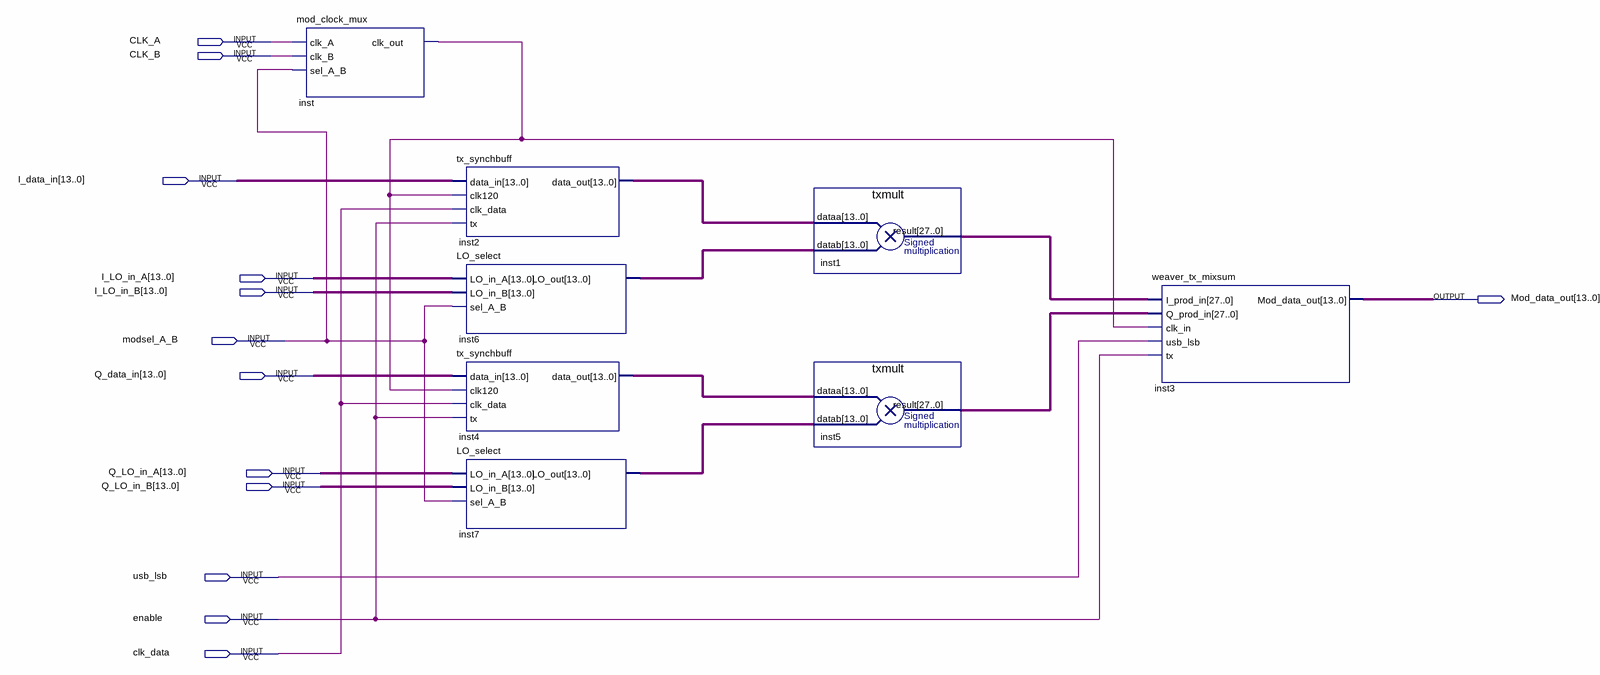
[diagram p0: schematic sheet]
// Quartus schematic weaver_tx_mult.bdf as structural Verilog: 8 symbols, 13 pins
module weaver_tx_mult (
  input  CLK_A,
  input  CLK_B,
  input  [13:0] I_data_in,
  input  [13:0] I_LO_in_A,
  input  [13:0] I_LO_in_B,
  input  modsel_A_B,
  input  [13:0] Q_data_in,
  input  [13:0] Q_LO_in_A,
  input  [13:0] Q_LO_in_B,
  input  usb_lsb,
  input  enable,
  input  clk_data,
  output [13:0] Mod_data_out
);

  wire inst_clk_out;
  wire [13:0] inst2_data_out, inst4_data_out, inst6_lo_out, inst7_lo_out;
  wire [27:0] inst1_result, inst5_result;

  mod_clock_mux inst (.clk_A(CLK_A), .clk_B(CLK_B), .sel_A_B(modsel_A_B), .clk_out(inst_clk_out));
  tx_synchbuff inst2 (
    .data_in(I_data_in), .clk120(inst_clk_out), .clk_data(clk_data), .tx(enable), .data_out(inst2_data_out));
  LO_select inst6 (.LO_in_A(I_LO_in_A), .LO_in_B(I_LO_in_B), .sel_A_B(modsel_A_B), .LO_out(inst6_lo_out));
  tx_synchbuff inst4 (
    .data_in(Q_data_in), .clk120(inst_clk_out), .clk_data(clk_data), .tx(enable), .data_out(inst4_data_out));
  LO_select inst7 (.LO_in_A(Q_LO_in_A), .LO_in_B(Q_LO_in_B), .sel_A_B(modsel_A_B), .LO_out(inst7_lo_out));
  txmult inst1 (.dataa(inst2_data_out), .datab(inst6_lo_out), .result(inst1_result));
  txmult inst5 (.dataa(inst4_data_out), .datab(inst7_lo_out), .result(inst5_result));
  weaver_tx_mixsum inst3 (
    .I_prod_in(inst1_result), .Q_prod_in(inst5_result), .clk_in(inst_clk_out), .usb_lsb(usb_lsb),
    .tx(enable), .Mod_data_out(Mod_data_out));
endmodule
